# EAGLE design sv650 (EAGLE 7.5.0)
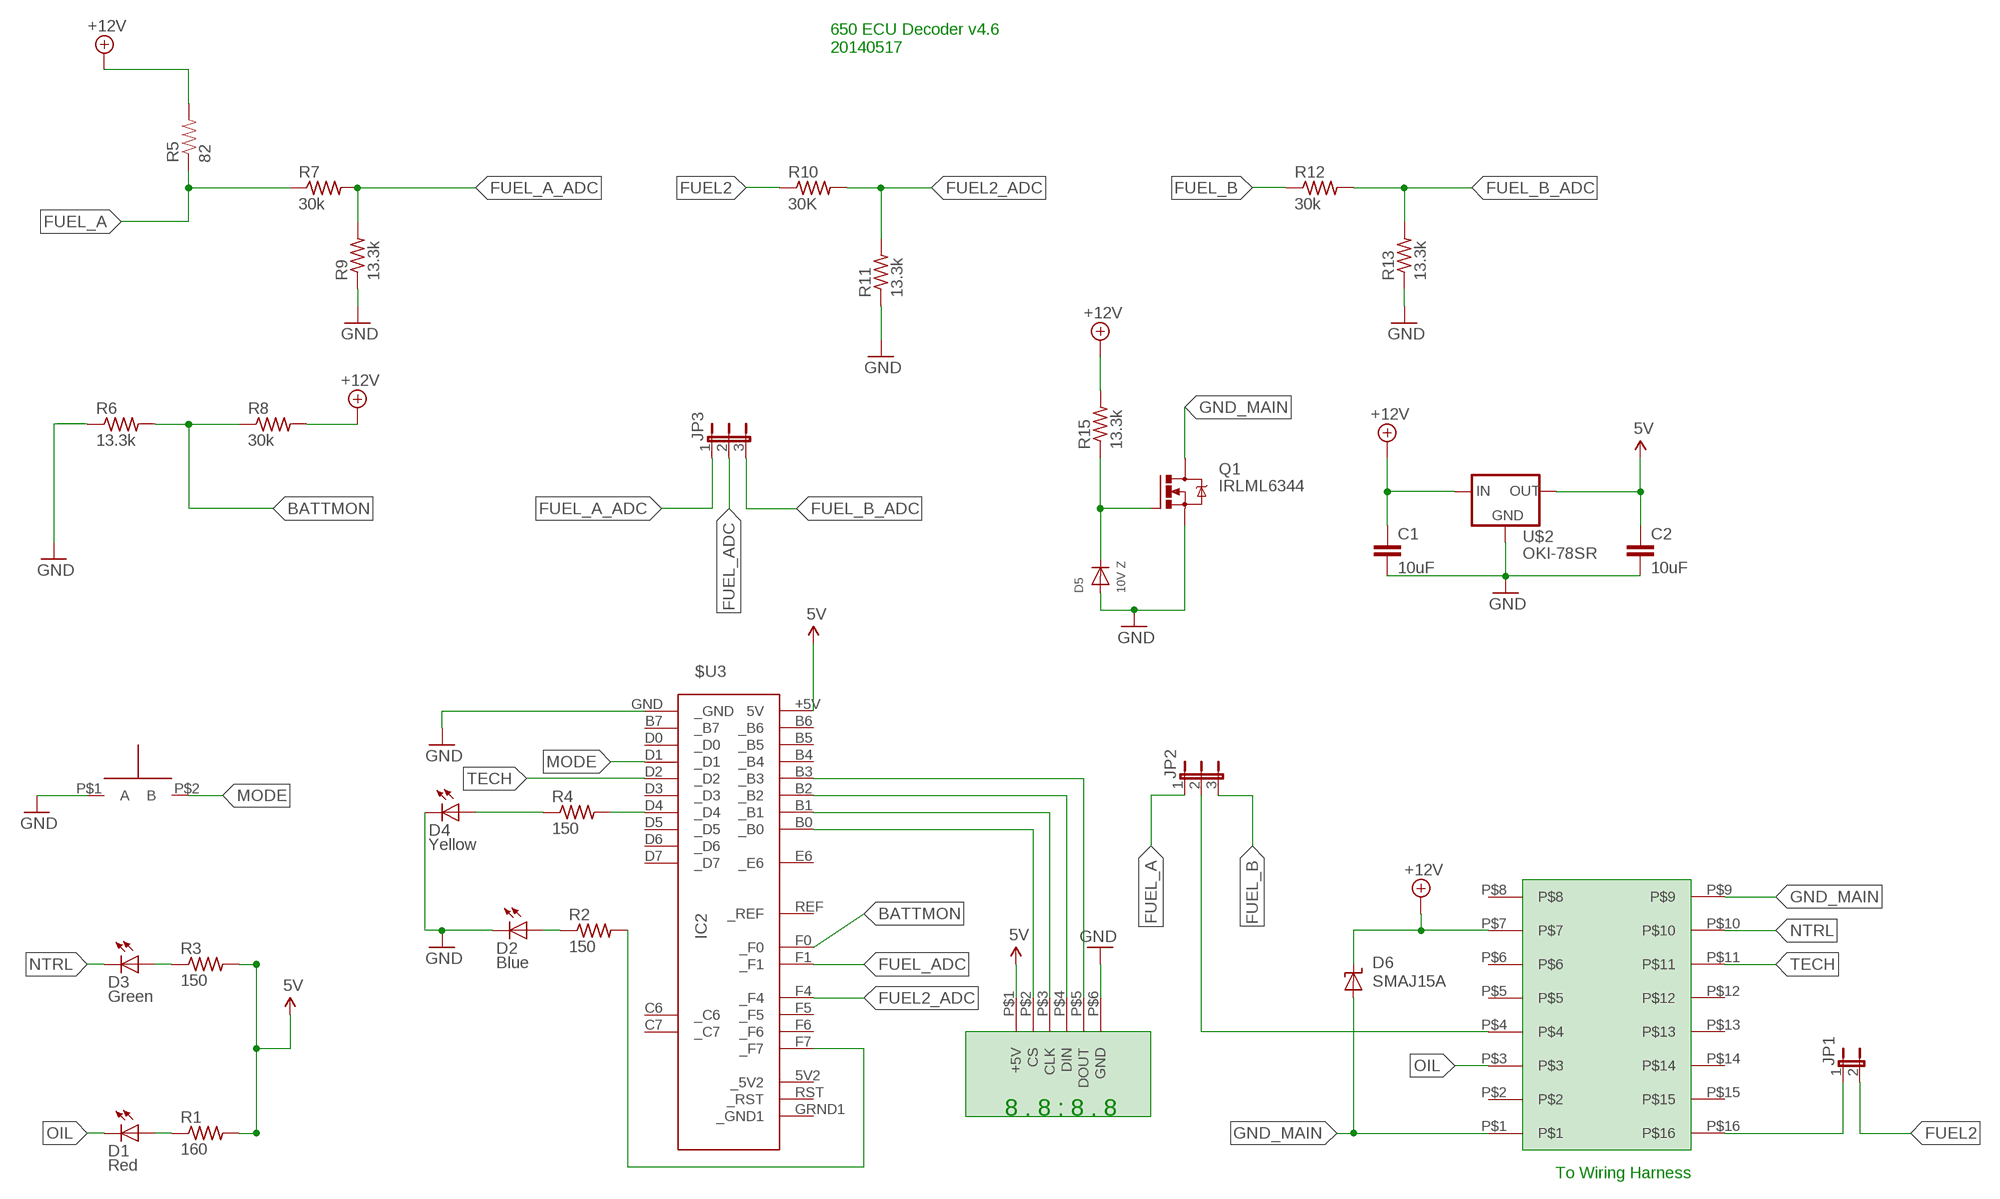
[diagram p0: schematic, sheet 1]

## Parts
$U3  IC2  TEENSY  [TEENSY]
C1  10uF  C-EUC0805  [C0805]
C2  10uF  C-EUC0805  [C0805]
D1  Red  LED10MM  [LED10MM]
D2  Blue  LED5MM  [LED5MM]
D3  Green  LED10MM  [LED10MM]
D4  Yellow  LED10MM  [LED10MM]
D5  10V Z  DIODESOD-123  [SOD-123]
D6  SMAJ15A  SUPPRESSOR-SMBG  [SMBG]
JP1  JP1E  [JP1]
JP2  JP2E  [JP2]
JP3  JP2E  [JP2]
Q1  IRLML6344  [SOT23]
R1  160  R-US_M0805  [M0805]
R2  150  R-US_M0805  [M0805]
R3  150  R-US_M0805  [M0805]
R4  150  R-US_M0805  [M0805]
R5  82  RESISTORPTH-5W  [AXIAL-0.9]
R6  13.3k  R-US_M0805  [M0805]
R7  30k  R-US_M0805  [M0805]
R8  30k  R-US_M0805  [M0805]
R9  13.3k  R-US_M0805  [M0805]
R10  30K  R-US_M0805  [M0805]
R11  13.3k  R-US_M0805  [M0805]
R12  30k  R-US_M0805  [M0805]
R13  13.3k  R-US_M0805  [M0805]
R15  13.3k  R-US_M0805  [M0805]
U$1  OASIS-7-SEG-DISPLAY  [OASIS-7-SEG-DISPLAY]
U$2  OKI-78SR  [OKI-78SR-H]
U$3  TE-174975-2  [TE-174975-2]
U$10  R13-509A-05-BB/R13-509A-05-BR  [R13-509A-05-BB/R13-509A-05-BR]

## Nets
5V: $U3.+5V(5V) C2.1 R1.2 R3.2 U$1.P$1(+5V) U$2.P$3(OUT)
+12V: C1.1 D6.C R5.P$2 R8.2 R15.2 U$2.P$1(IN) U$3.P$7
BATTMON: $U3.F0(_F0) R6.2 R8.1
FUEL2: JP1.2 R10.1
FUEL2_ADC: $U3.F4(_F4) R10.2 R11.2
FUEL_A: JP2.1 R5.P$1 R7.1
FUEL_A_ADC: JP3.1 R7.2 R9.2
FUEL_ADC: $U3.F1(_F1) JP3.2
FUEL_B: JP2.3 R12.1
FUEL_B_ADC: JP3.3 R12.2 R13.2
GND: $U3.GND(_GND) C1.2 C2.2 D2.K(C) D4.K(C) D5.A Q1.2(S) R6.1 R9.1 R11.1 R13.1 U$1.P$6(GND) U$2.P$2(GND) U$10.P$1(A)
GND_MAIN: D6.A Q1.3(D) U$3.P$1 U$3.P$9
MODE: $U3.D1(_D1) U$10.P$2(B)
N$2: $U3.B0(_B0) U$1.P$2(CS)
N$3: $U3.B1(_B1) U$1.P$3(CLK)
N$4: $U3.B2(_B2) U$1.P$4(DIN)
N$5: $U3.B3(_B3) U$1.P$5(DOUT)
N$6: D3.A R3.1
N$7: D2.A R2.1
N$8: D1.A R1.1
N$9: $U3.D4(_D4) R4.2
N$12: JP2.2 U$3.P$4
N$14: JP1.1 U$3.P$16
N$16: $U3.F7(_F7) R2.2
N$17: D5.C Q1.1(G) R15.1
NTRL: D3.K(C) U$3.P$10
OIL: D1.K(C) U$3.P$3
R2: D4.A R4.1
TECH: $U3.D2(_D2) U$3.P$11
Unconnected: $U3.5V2(_5V2) $U3.B4(_B4) $U3.B5(_B5) $U3.B6(_B6) $U3.B7(_B7) $U3.C6(_C6) $U3.C7(_C7) $U3.D0(_D0) $U3.D3(_D3) $U3.D5(_D5) $U3.D6(_D6) $U3.D7(_D7) $U3.E6(_E6) $U3.F5(_F5) $U3.F6(_F6) $U3.GRND1(_GND1) $U3.REF(_REF) $U3.RST(_RST) U$3.P$2 U$3.P$5 U$3.P$6 U$3.P$8 U$3.P$12 U$3.P$13 U$3.P$14 U$3.P$15

## Notes on the sheet
- 650 ECU Decoder v4.6
  20140517
- To Wiring Harness

## Library data of the parts
$U3 = teensy:TEENSY: Teensy 2.0 Original Design by Clint Fisher Modified Design by Tamir Emran Licensed Under Creative Commons Attribution-ShareAlike 3.0 Unported (CC BY-SA 3.0); OC_NEWARK: unknown
C1 C2 = resistor:C-EU: CAPACITOR, European symbol
D1-D4 = led:LED: LED OSRAM: - CHIPLED LG R971, LG N971, LY N971, LG Q971, LY Q971, LO R971, LY R971 LH N974, LH R974 LS Q976, LO Q976, LY Q976 LO Q996 - Hyper CHIPLED LW Q18S LB Q993, LB Q99A, LB R99A - SideLED LS A670, LO A670, LY A670, LG A670, LP A670 LB A673, LV A673, LT A673, LW A673 LH A674 LY A675 LS A676, LA A676, LO A676, LY A676, LW A676 LS A679, LY A679, LG A679 - Hyper Micro SIDELED® LS Y876, LA Y876, LO Y876, LY Y876 LT Y87S - SmartLED LW L88C, LW L88S LB L89C, LB L89S, LG L890 LS L89K, LO L89K, LY L89K LS L896, LA L896, LO L896, LY L896 - TOPLED LS T670, LO T670, LY T670, LG T670, LP T670 LSG T670, LSP T670, LSY T670, LOP T670, LYG T670 LG T671, LOG T671, LSG T671 LB T673, LV T673, LT T673, LW T673 LH T674 LS T676, LA T676, LO T676, LY T676, LB T676, LH T676, LSB T676, LW T676 LB T67C, LV T67C, LT T67C, LS T67K, LO T67K, LY T67K, LW E67C LS E67B, LA E67B, LO E67B, LY E67B, LB E67C, LV E67C, LT E67C LW T67C LS T679, LY T679, LG T679 LS T770, LO T770, LY T770, LG T770, LP T770 LB T773, LV T773, LT T773, LW T773 LH T774 LS E675, LA E675, LY E675, LS T675 LS T776, LA T776, LO T776, LY T776, LB T776 LHGB T686 LT T68C, LB T68C - Hyper Mini TOPLED® LB M676 - Mini TOPLED Santana® LG M470 LS M47K, LO M47K, LY M47K Source: http://www.osram.convergy.de LUXEON: - LUMILED® LXK2-PW12-R00, LXK2-PW12-S00, LXK2-PW14-U00, LXK2-PW14-V00 LXK2-PM12-R00, LXK2-PM12-S00, LXK2-PM14-U00 LXK2-PE12-Q00, LXK2-PE12-R00, LXK2-PE12-S00, LXK2-PE14-T00, LXK2-PE14-U00 LXK2-PB12-K00, LXK2-PB12-L00, LXK2-PB12-M00, LXK2-PB14-N00, LXK2-PB14-P00, LXK2-PB14-Q00 LXK2-PR12-L00, LXK2-PR12-M00, LXK2-PR14-Q00, LXK2-PR14-R00 LXK2-PD12-Q00, LXK2-PD12-R00, LXK2-PD12-S00 LXK2-PH12-R00, LXK2-PH12-S00 LXK2-PL12-P00, LXK2-PL12-Q00, LXK2-PL12-R00 Source: www.luxeon.com KINGBRIGHT: KA-3528ASYC Source: www.kingbright.com; OC_NEWARK: unknown
D5 = adafruit:DIODE: Diode SMADIODE - SMA Surface Mount Package 20V 1A Schottky Diode Digikey: 641-1014-6-ND DO-1N4148 - Through Hole Small Current Diode SOD-123 20V 1 A (.5mV Vf) Schottky Diode - Digikey: MBRX120TPMSCT-ND SOD-323 10V 570mA (.38mV Vf, 3ns) Schottky Diode - Digikey: ZLLS410CT-ND SOD-523 30V 30mA Schottky Diode (RB751S-40TE61) - Digikey: RB751S-40TE61CT-ND SOT23-R/W - SOT23 Package (R = Solder Paste/Reflow Ovens, W = Hand-Soldering) BAT54Film 40V 300mA - Digikey: 497-7162-1-ND
D6 = diode:SUPPRESSOR-: Suppressor diode
JP1 = jumper:JP1E: JUMPER
JP2 JP3 = jumper:JP2E: JUMPER
Q1 = synfinatic:IRLML6344: N-CHANNEL MOS FET
R1 = resistor:R-US_: RESISTOR, American symbol; MF: VISHAY/DALE; MPN: CRCW0805160RFKEA; OC_NEWARK: 52K9907
R2-R4 = resistor:R-US_: RESISTOR, American symbol; MPN: MCHP05W4F1500T5E; OC_NEWARK: 01N7000
R5 = synfinatic:RESISTOR: Resistor Basic schematic elements and footprints for 0603, 1206, and PTH resistors.
R6 R8 = resistor:R-US_: RESISTOR, American symbol; MF: VISHAY/DALE; MPN: CRCW080510K0FKTA; OC_NEWARK: 05F1511
R7 R9-R13 R15 = resistor:R-US_: RESISTOR, American symbol
U$1 = synfinatic:OASIS-7-SEG-DISPLAY: Oasis 7 Seg Display Available in 10 packs off ebay. Has a simple serial interface; OC_NEWARK: unknown
U$2 = synfinatic:OKI-78SR: Murata OKI-78SR LM78xx replacement
U$3 = synfinatic:TE-174975-2: TE/AMP 174975-2 connector 16 pin connector; OC_NEWARK: unknown
U$10 = synfinatic:R13-509A-05-BB/R13-509A-05-BR: Multicomp Pushbutton SPST switches R13-509A-05-BB (black) and R13-509A-05-BR (red)

## Board
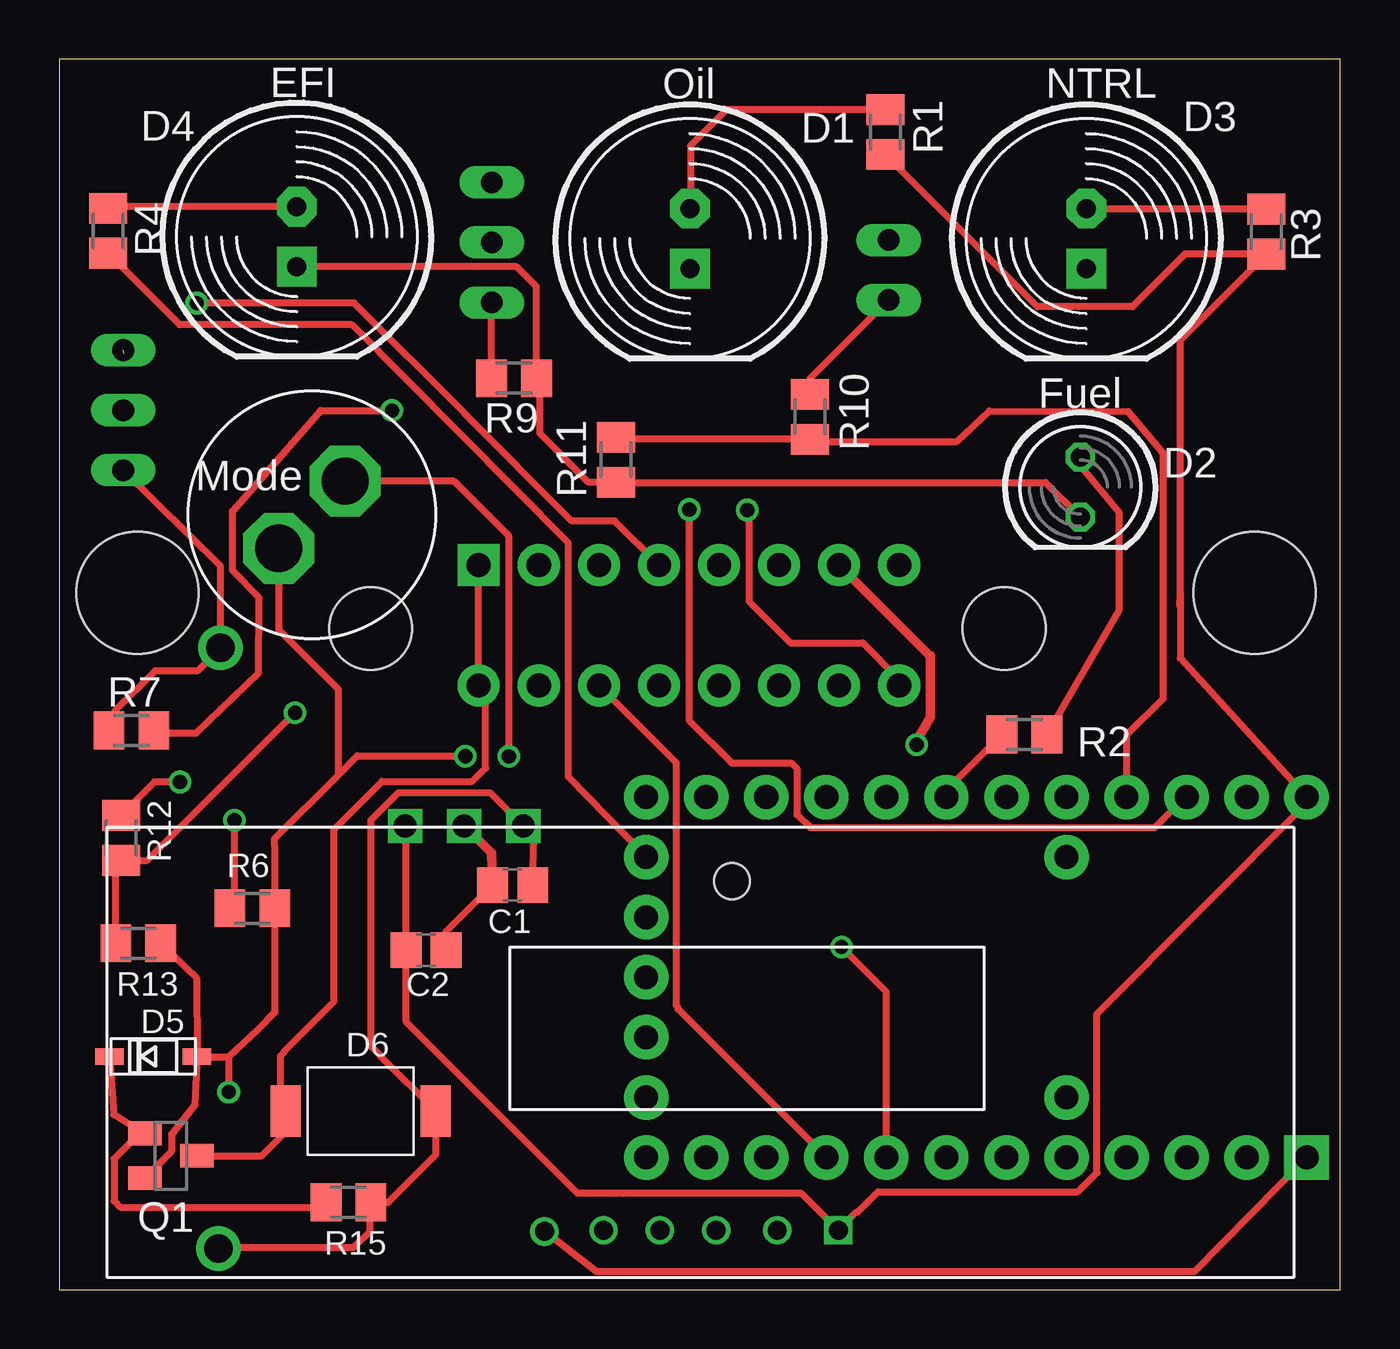
[diagram p1: board, top side]
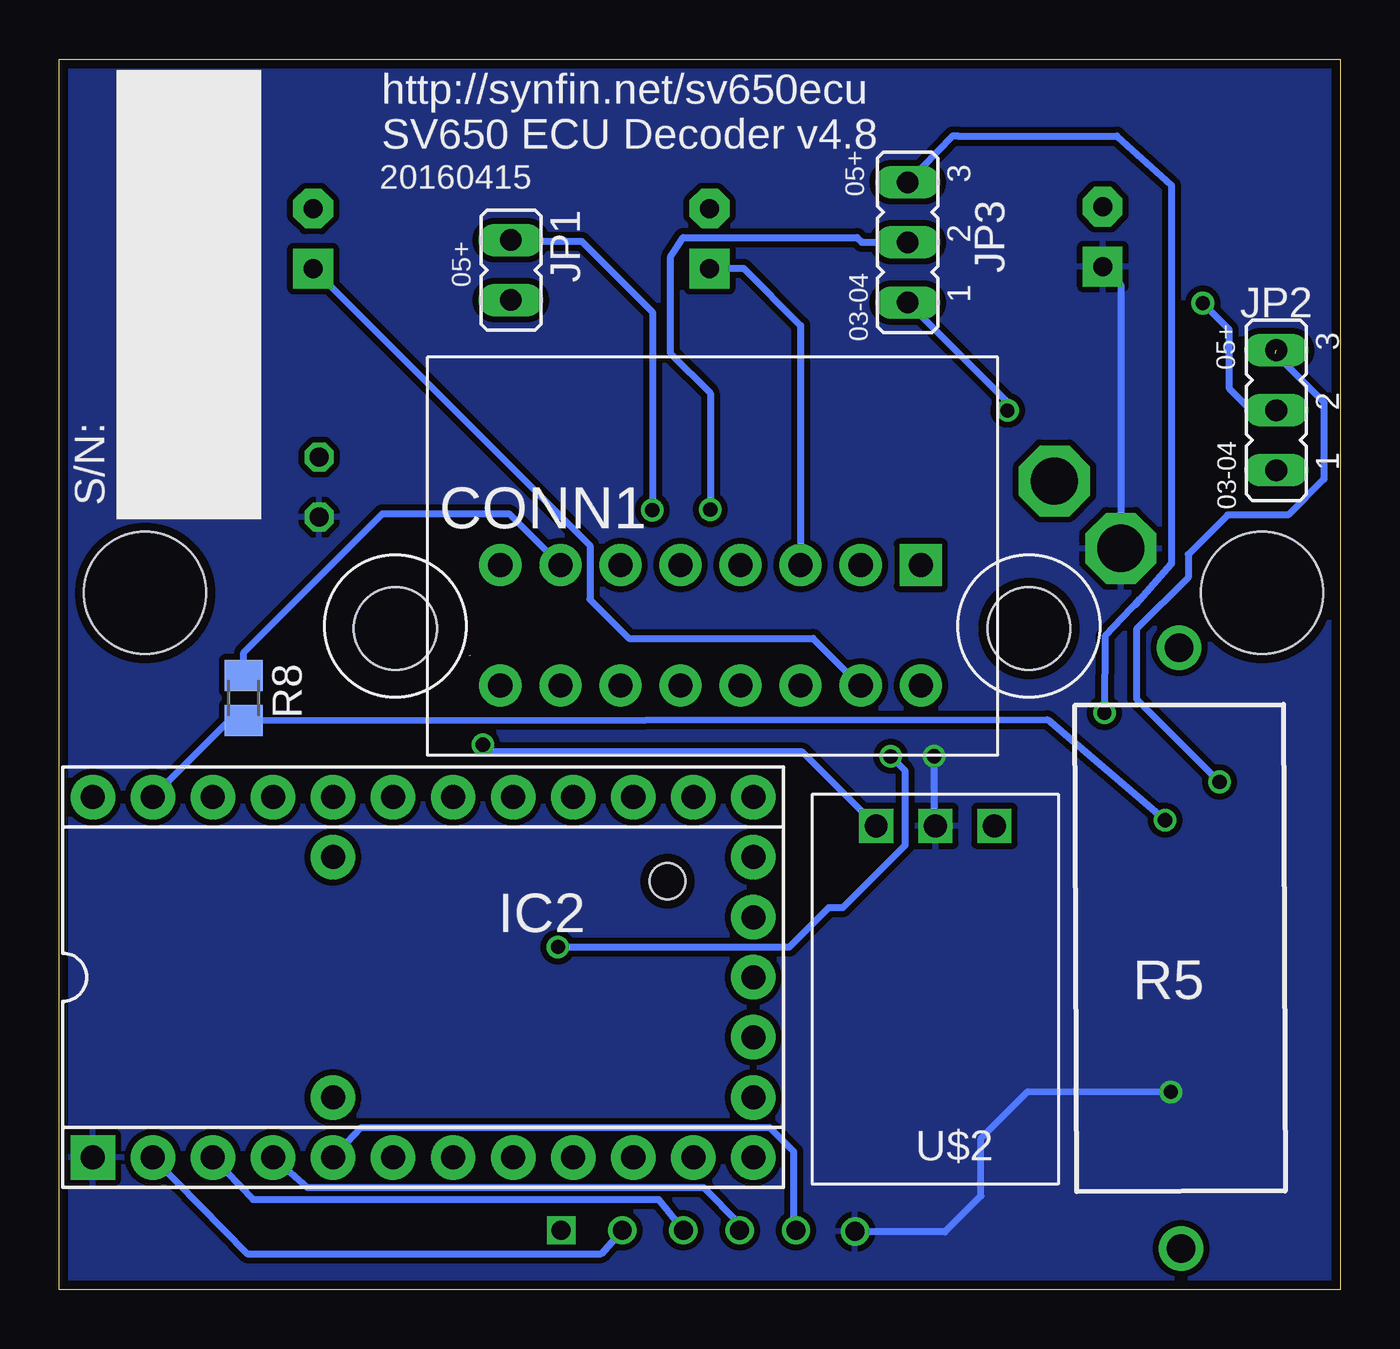
[diagram p2: board, bottom side, seen from below]

Size 54.19 x 52.04 mm. Coordinates in mm from the lower left corner, seen from the top.
Outline: 0,0 54.19,0 54.18,52.04 0,52.03 0,0
Copper layers (1*16): Top 0.0356mm / dielectric 1.5011mm / Bottom 0.0356mm
Design rules "LaenPCBOrder": minimum track width 6mil, minimum drill 13mil, track to track 6mil, track to pad 6mil, pad to pad 6mil, via to via 6mil, smd to smd 6mil, copper to edge 15mil, drill to drill 6mil, minimum pad ring 7mil, minimum via ring 7mil, stop-mask expansion 4mil, vias tented up to drill 0mil, thermal gap 10mil
Holes 5.16 mm at 3.31,29.46 50.56,29.46

### Footprints (pad centres in the part's own frame; a part is rotated, then mirrored left to right if it is on the bottom)
TEENSY = drill 1.016 pad 1.88: 5V2 13.97,-2.54; +5V -13.97,7.62; B0 -11.43,-7.62; B1 -8.89,-7.62; B2 -6.35,-7.62; B3 -3.81,-7.62; B4 8.89,7.62; B5 6.35,7.62; B6 3.81,7.62; B7 -1.27,-7.62; C6 11.43,-7.62; C7 13.97,-7.62; D0 1.27,-7.62; D1 3.81,-7.62; D2 6.35,-7.62; D3 8.89,-7.62; D4 13.97,5.08; D5 13.97,-5.08; D6 13.97,7.62; D7 11.43,7.62; E6 -3.81,-5.08; F0 -11.43,7.62; F1 -8.89,7.62; F4 -6.35,7.62; F5 -3.81,7.62; F6 -1.27,7.62; F7 1.27,7.62; GRND1 13.97,0; REF -3.81,5.08; RST 13.97,2.54 | drill 1.016 pad 1.88 square: GND -13.97,-7.62
C0805 = smd 1.3 x 1.5: 1 -0.85,0; 2 0.85,0
LED10MM = drill 0.813 pad 1.676 octagon: A -1.27,0 | drill 0.813 pad 1.676 square: K 1.27,0
LED5MM = drill 0.813 octagon: A -1.27,0; K 1.27,0
SOD-123 = smd 1.2 x 0.7: A 1.85,0; C -1.85,0
SMBG = smd 1.27 x 2.16: A 3.17,0; C -3.17,0
JP1 = drill 0.914 long: 1 0,-1.27; 2 0,1.27
JP2 = drill 0.914 long: 1 -2.54,0; 2 0,0; 3 2.54,0
SOT23 = smd 1 x 1.4: 1 -0.95,-1.1; 2 0.95,-1.1; 3 0,1.1
M0805 = smd 1.3 x 1.6: 1 -0.95,0; 2 0.95,0
AXIAL-0.9 = drill 1.2 pad 1.88: P$1 -11.43,0.635; P$2 13.97,0.635
OASIS-7-SEG-DISPLAY = drill 0.8 square: P$1 30.913,2 | drill 0.8: P$2 28.33,2; P$3 25.747,2; P$4 23.365,2; P$5 20.983,2; P$6 18.483,1.95
OKI-78SR-H = drill 0.965 square: P$1 7.7,1.35; P$2 5.2,1.35; P$3 2.7,1.35
TE-174975-2 = drill 1.016 pad 1.778 square: P$1 20.87,8.03 | drill 1.016 pad 1.778: P$2 18.33,8.03; P$3 15.79,8.03; P$4 13.25,8.03; P$5 10.71,8.03; P$6 8.17,8.03; P$7 5.63,8.03; P$8 3.09,8.03; P$9 20.87,2.95; P$10 18.33,2.95; P$11 15.79,2.95; P$12 13.25,2.95; P$13 10.71,2.95; P$14 8.17,2.95; P$15 5.63,2.95; P$16 3.09,2.95 | hole 3.5: -1.35,5.35; 25.45,5.35
STANDOFF = hole 1.524: 0,0
R13-509A-05-BB/R13-509A-05-BR = drill 2 pad 2.54 octagon: P$1 -2,0; P$2 2,0.03

### Placement (x,y rotation side)
$U3  38.8,13.21 0 bottom
C1  19.18,17.11 180 top
C2  15.52,14.36 0 top
D1  26.68,44.45 270 top
D2  43.19,33.94 270 top
D3  43.44,44.45 270 top
D4  10.05,44.53 270 top
D5  3.98,9.86 0 top
D6  12.75,7.55 180 top
JP1  35.08,43.12 180 bottom
JP2  2.71,37.19 90 bottom
JP3  18.3,44.29 90 bottom
Q1  4.73,5.66 270 top
R1  34.95,48.95 270 top
R2  40.83,23.48 180 top
R3  51.05,44.74 270 top
R4  2.07,44.78 270 top
R5  7.42,15.71 270.2 bottom
R6  8.18,16.13 180 top
R7  3.06,23.65 0 top
R8  46.38,25.02 90 bottom
R9  19.24,38.54 180 top
R10  31.76,36.91 270 top
R11  23.56,35.09 90 top
R12  2.62,19.1 270 top
R13  3.35,14.65 180 top
R15  12.24,3.69 0 top
U$1  2.04,0.51 0 top
U$2  11.93,20.96 180 bottom
U$3  38.62,22.61 0 bottom
U$5  [STANDOFF]  28.46,17.27 0 top
U$10  10.7,32.76 45 top

### Tracks (layer width: path | path; a pad name or v marks a point on that pad's centre or on a via)
5V
  Top 0.305: 47.41,29.48 47.41,26.71 $U3.+5V 52.77,20.58 43.91,11.68 43.89,11.66 43.89,4.93 43.08,4.14 34.64,4.14 33.78,3.28 33.73,3.28 U$1.P$1 31.39,4.07 23.86,4.07 21.92,4.08 14.68,11.32 C2.1 14.67,19.57 U$2.P$3 | 47.39,28.93 47.41,29.48 | R1.2 41.38,41.57 45.39,41.57 47.61,43.79 R3.2 47.41,40.15 47.41,29.48
+12V  (via drill 0.6)  (1 unrouted)
  Top 0.305: R5.P$2 6.77,1.78 12.46,1.78 13.15,2.47 13.15,3.65 R15.2 13.92,3.69 15.94,5.71 15.94,7.52 D6.C 13.59,9.87 13.59,9.88 13.19,10.28 13.19,19.86 14.35,21.02 18.22,21.02 U$2.P$1 20.08,19.16 C1.1 | v36.27,23.04 36.27,23.19
  Top 0.406: 36.27,23.19 36.27,23.23 36.85,24.22 36.85,26.81 | 36.78,26.84 U$3.P$7
  Bottom 0.305: U$3.P$7 35.16,32.81 40.51,32.81 46.38,26.94 R8.2 | v36.27,23.04 35.96,22.73 22.75,22.73 U$2.P$1
BATTMON  (via drill 0.6)
  Top 0.305: v7.41,19.85 7.41,16.31 R6.2
  Bottom 0.305: $U3.F0 46.95,24.11 R8.1 12.4,24.11 v7.41,19.85
FUEL2
  Top 0.305: R10.1 31.76,38.53 JP1.2
FUEL2_ADC
  Top 0.305: R11.2 23.64,35.96 R10.2 31.85,35.87 37.97,35.87 39.34,37.16 45.22,37.14 46.68,35.4 46.68,24.98 45.15,23.45 $U3.F4
FUEL_A
  Top 0.305: R7.1 2.36,24.47 4.06,26.17 5.85,26.17 R5.P$1 6.83,30.59 JP2.1
FUEL_A_ADC  (via drill 0.6)
  Top 0.305: v14.08,37.18 11.05,37.18 7.33,32.93 7.34,30.42 8.46,29.26 8.43,26.08 5.8,23.53 4.41,23.53 R7.2 | 18.23,41.74 JP3.1 R9.2
  Bottom 0.305: v14.08,37.18 14.08,37.53 JP3.1
FUEL_ADC  (via drill 0.6)
  Top 0.305: $U3.F1 | $U3.F1 | v26.65,32.99 26.65,24.07 28.45,22.27 30.97,22.27 31.2,22.04 31.2,20.09 31.77,19.54 46.34,19.54 47.65,20.83 $U3.F1
  Bottom 0.305: v26.65,32.99 26.65,37.91 28.33,39.59 28.33,43.69 27.8,44.49 20.44,44.49 20.24,44.29 JP3.2
FUEL_B  (via drill 0.6)  (1 unrouted)
  Top 0.305: v5.11,21.47 4.04,21.47 R12.1
  Bottom 0.305: 2.76,39.59 0.7,37.53 0.7,34.27 2.21,32.76 4.77,32.76 6.44,31.09 6.44,30.11 8.62,27.93 8.62,24.98 v5.11,21.47
FUEL_B_ADC  (via drill 0.6)
  Top 0.305: R13.2 2.4,17.93 R12.2 3.73,18.15 v9.98,24.4
  Bottom 0.305: v9.98,24.4 9.96,27.64 8.49,29.2 8.66,28.97 7.14,30.69 7.14,46.7 9.45,48.78 16.17,48.79 16.4,48.79 JP3.3
GND  (via drill 0.6)
  Top 0.305: U$1.P$6 22.73,0.76 48.02,0.76 $U3.GND | 7.17,9.85 8.39,10.98 9.12,11.71 R6.1 9.12,18.75 9.12,19.07 11.79,21.75 | 7.17,9.85 v7.17,8.36 | 17.16,22.56 v17.18,22.56 v17.17,22.57 12.61,22.57 11.79,21.75 | U$10.P$1 9.29,27.91 11.79,25.41 11.79,21.75 | D5.A 5.74,7.82 4.76,6.57 4.76,5.84 Q1.2 | C2.2 16.37,15.15 C1.2 | D2.K 41.72,34.14 R11.1 22.4,34.14 20.33,36.21 20.33,38.43 R9.1 20.19,42.42 19.35,43.26 D4.K | R13.1 5.81,13.18 D5.A | D5.A 6.18,9.85 7.17,9.85
  Top 0.406: C1.2 18.28,18.46 U$2.P$2
  Bottom 0.305: 9.38,31.44 U$10.P$1 9.29,42.5 D4.K | U$1.P$6 16.74,2.46 16.72,2.44 15.2,3.96 15.2,6.39 13.21,8.38 v7.17,8.36 | U$2.P$2 17.18,19.61 v17.18,22.56
  pour Bottom (isolate 0.254): 0.47,51.62 53.85,51.62 53.92,51.55 53.84,0.38 0.31,0.38
GND_MAIN
  Top 0.305: U$3.P$1 U$3.P$9 18.04,25.26 18.04,22.06 17.47,21.49 13.65,21.49 11.63,19.47 11.63,12.19 9.5,10.06 9.5,10.02 9.35,9.87 9.35,7.79 D6.A 9.61,7.53 9.61,6.7 8.57,5.66 Q1.3
MODE  (via drill 0.6)
  Top 0.305: $U3.D1 34.99,12.59 v33.09,14.49 | v19.02,22.55 19.02,31.87 16.7,34.19 U$10.P$2
  Bottom 0.305: v33.09,14.49 23.3,14.49 21.63,16.16 21.04,16.16 18.4,18.8 18.4,21.93 v19.02,22.55
N$2
  Bottom 0.305: U$1.P$2 31.25,1.52 46.24,1.52 $U3.B0
N$3
  Bottom 0.305: $U3.B1 45.98,3.81 28.84,3.81 U$1.P$3
N$4
  Bottom 0.305: $U3.B2 43.7,4.32 26.93,4.32 25.41,2.79 U$1.P$4
N$5
  Bottom 0.305: $U3.B3 41.41,6.86 24.14,6.86 23.12,5.84 23.12,2.86 U$1.P$5
N$6
  Top 0.305: R3.1 43.44,45.69 D3.A
N$7
  Top 0.305: D2.A 43.19,34.85 44.82,32.88 44.82,28.73 R2.1
N$8
  Top 0.305: D1.A 26.7,45.74 26.7,48.37 28.24,49.91 R1.1
  Bottom 0.305: D1.A
N$9
  Top 0.305: $U3.D4 24.83,18.32 21.54,21.68 21.54,31.57 12.39,40.81 5.09,40.81 R4.2
N$12  (via drill 0.6)
  Top 0.305: U$3.P$4 23.49,32.51 21.68,32.51 17.14,37.05 17.14,37.06 12.48,41.72 v5.82,41.72
  Bottom 0.305: v5.82,41.72 4.71,40.61 4.71,38.13 3.78,37.2 JP2.2
N$14  (via drill 0.6)
  Top 0.305: v29.1,32.97 29.18,32.89 29.18,29.11 30.94,27.35 33.99,27.35 35.53,25.81 U$3.P$16
  Bottom 0.305: v29.1,32.97 29.1,41.34 32.08,44.32 35.01,44.32 JP1.1
N$16
  Top 0.305: R2.2 37.53,21.13 $U3.F7
N$17
  Top 0.305: D5.C 2.3,7.41 Q1.1 3.4,6.61 2.33,5.54 2.33,3.75 2.59,3.49 10.67,3.49 R15.1
NTRL
  Bottom 0.305: D3.K 31.74,31.48 31.74,29.19 30.09,27.54 22.3,27.54 20.32,25.56 U$3.P$10
OIL
  Bottom 0.305: U$3.P$3 22.83,40.78 25.23,43.18 D1.K
R2
  Top 0.305: R4.1 2.23,45.73 2.31,45.81 10.08,45.81 D4.A
TECH
  Top 0.305: $U3.D2 26.17,11.86 26.17,11.94 26.1,12.01 26.1,22.29 U$3.P$11

### Text on the board
bPlace: http://synfin.net/sv650ecu / SV650 ECU Decoder v4.8 | 20160415 | S/N:
tNames: Mode
bNames: CONN1
tSilk: EFI | Oil | NTRL | Fuel
_bsilk: 05+ | 05+ | 03-04 | 05+ | 03-04 | U$2